# Altium schematic sheet Top_Level.SchDoc
size D
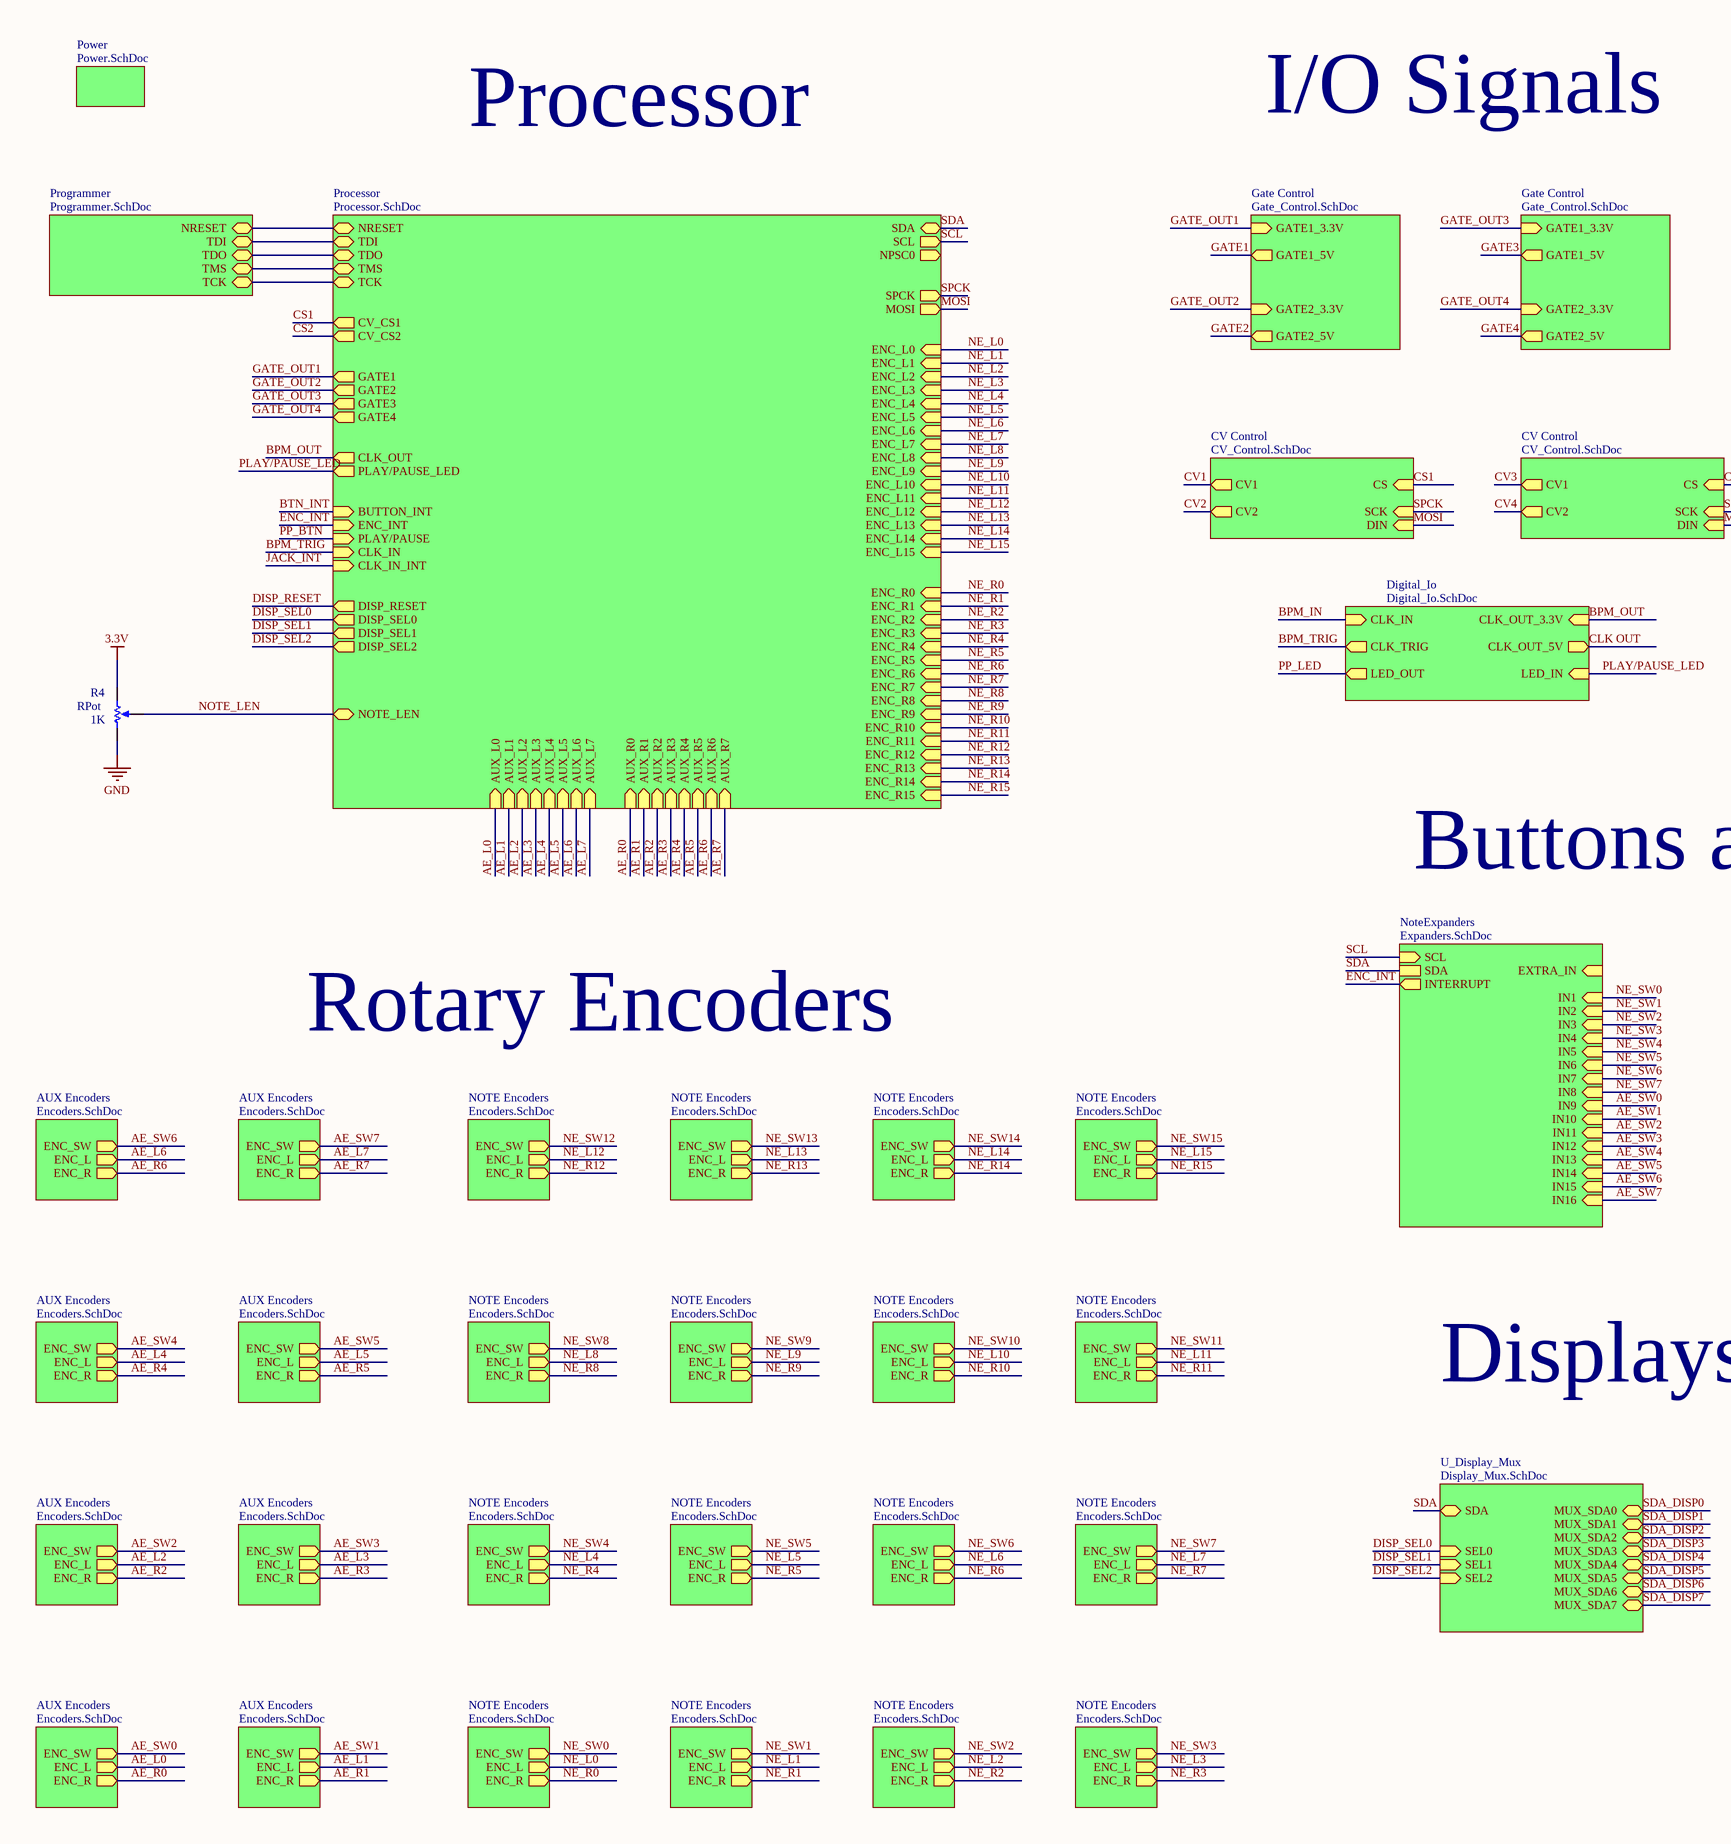
[diagram p0: Top_Level.SchDoc, left]
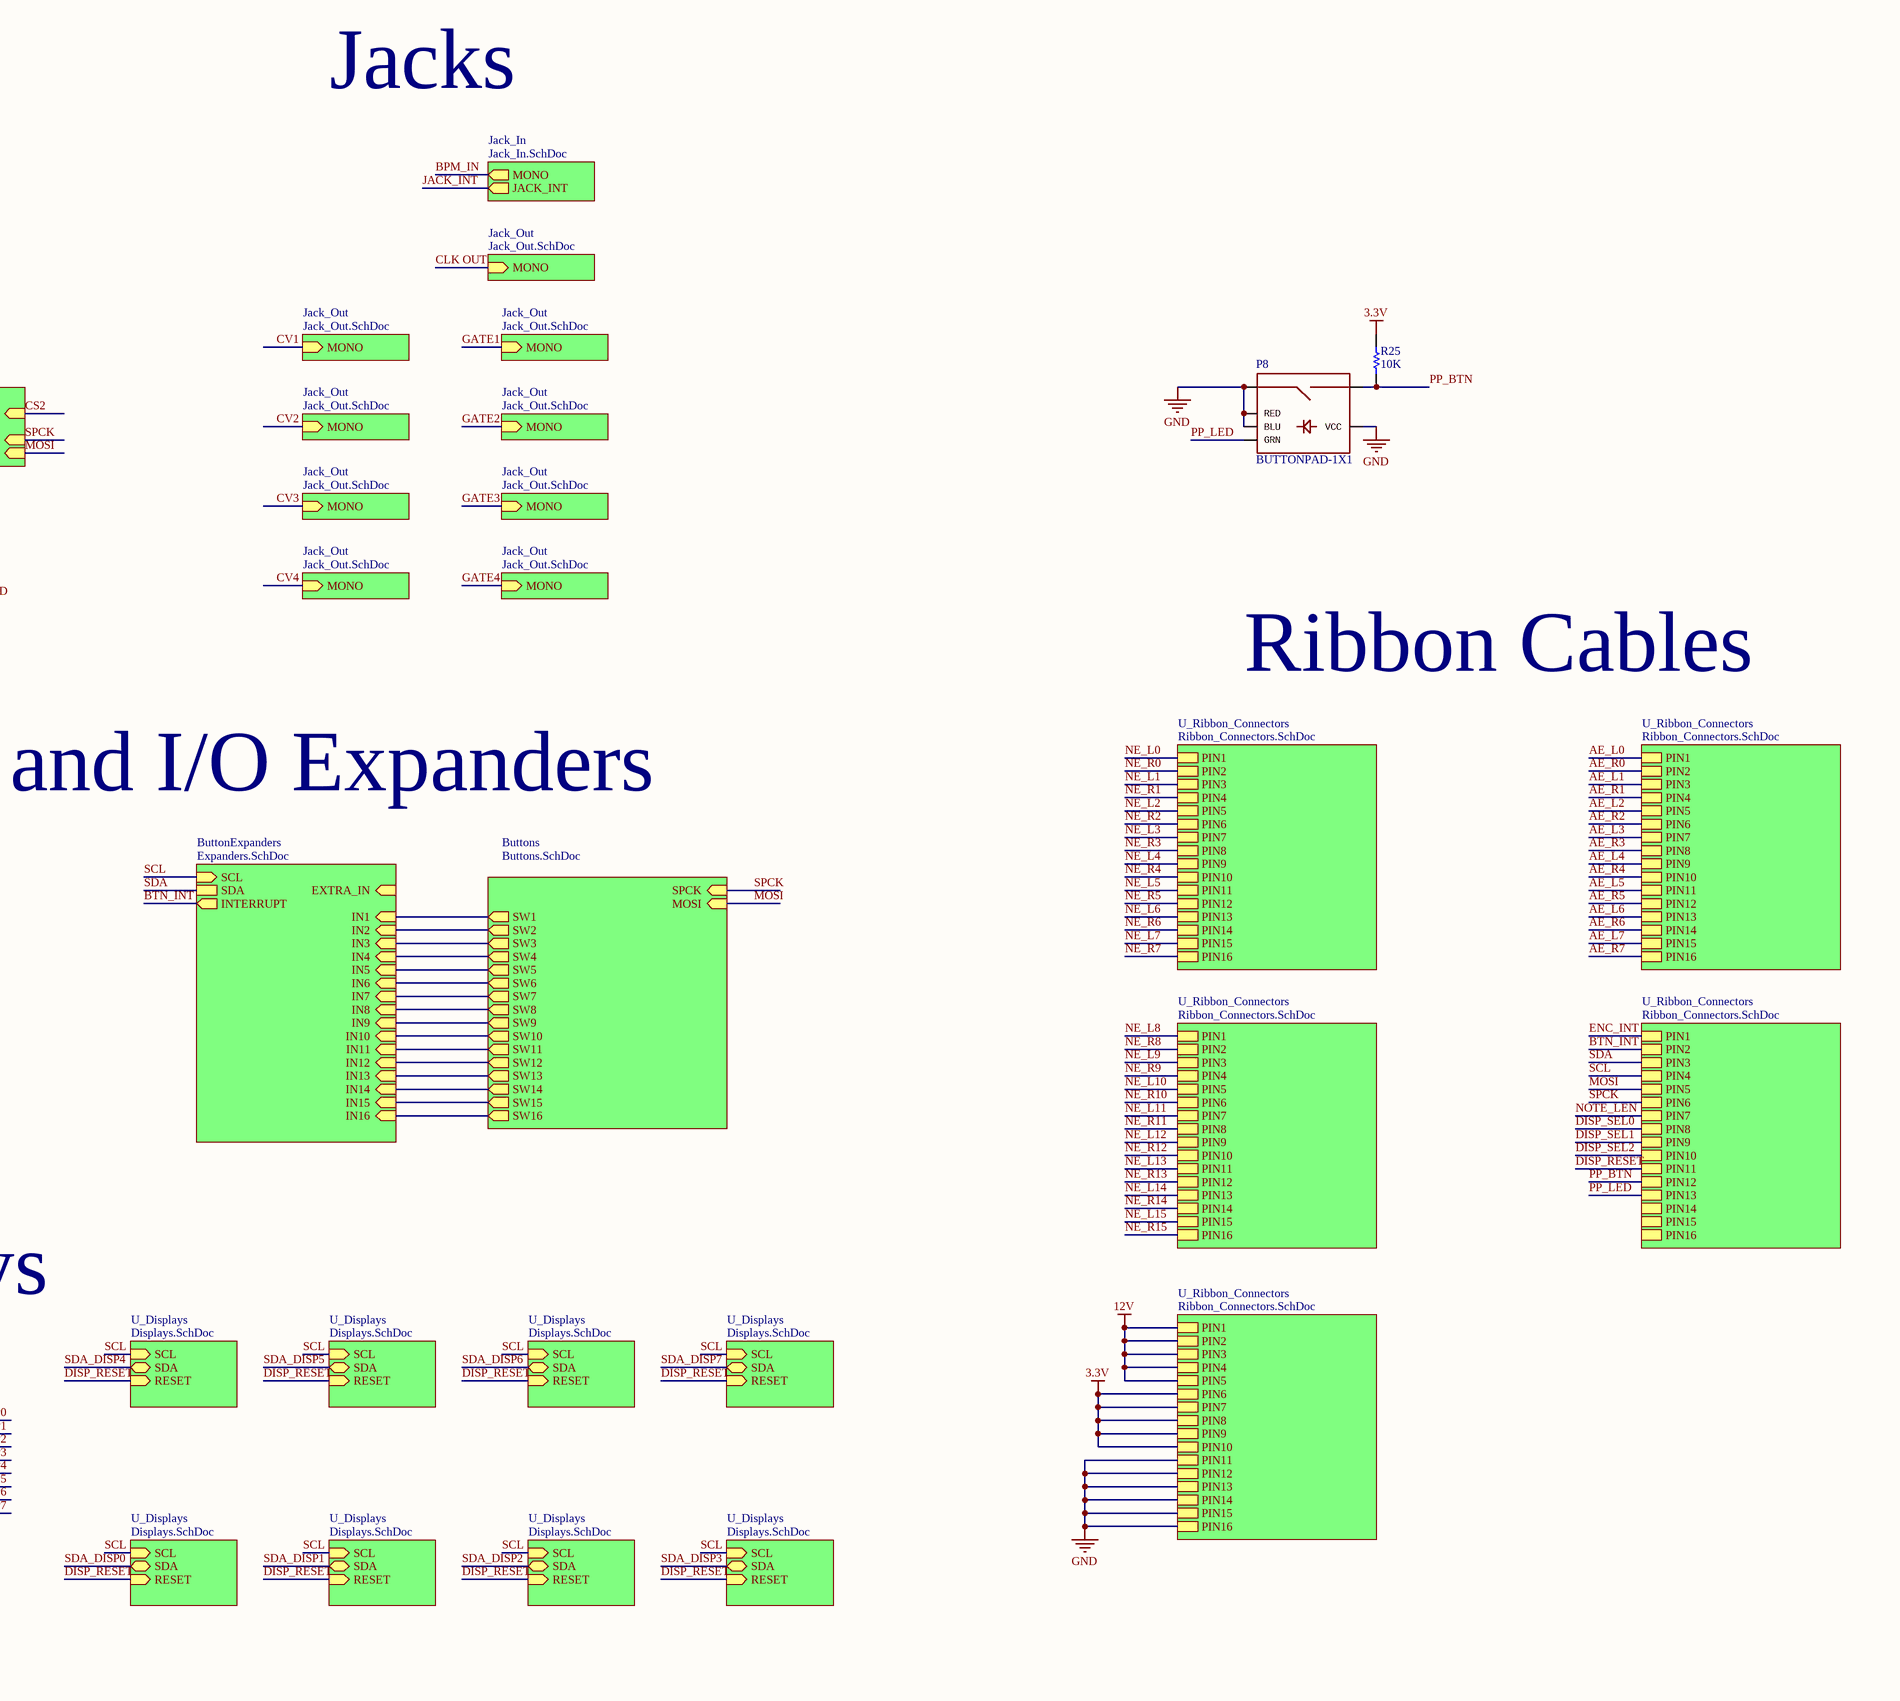
[diagram p1: Top_Level.SchDoc, right]

## Parts
P8  BUTTONPAD-1X1  [BUTTONPAD-1X1]
R4  RPot  value 1K  [POT inline wide]
R25  value 10K  [AXIAL-0.3]  (hidden comment: R3)

## Sub-sheets
AUX Encoders = Encoders.SchDoc: ENC_SW (out), ENC_L (out), ENC_R (out)
AUX Encoders = Encoders.SchDoc: ENC_SW (out), ENC_L (out), ENC_R (out)
AUX Encoders = Encoders.SchDoc: ENC_SW (out), ENC_L (out), ENC_R (out)
AUX Encoders = Encoders.SchDoc: ENC_SW (out), ENC_L (out), ENC_R (out)
AUX Encoders = Encoders.SchDoc: ENC_SW (out), ENC_L (out), ENC_R (out)
AUX Encoders = Encoders.SchDoc: ENC_SW (out), ENC_L (out), ENC_R (out)
AUX Encoders = Encoders.SchDoc: ENC_SW (out), ENC_L (out), ENC_R (out)
AUX Encoders = Encoders.SchDoc: ENC_SW (out), ENC_L (out), ENC_R (out)
ButtonExpanders = Expanders.SchDoc: SCL (in), SDA, EXTRA_IN (in), INTERRUPT (out), IN1 (in), IN2 (in), IN3 (in), IN4 (in), IN5 (in), IN6 (in), IN7 (in), IN8 (in), IN9 (in), IN10 (in), IN11 (in), IN12 (in), IN13 (in), IN14 (in), IN15 (in), IN16 (in)
Buttons = Buttons.SchDoc: SPCK (in), MOSI (in), SW1 (out), SW2 (out), SW3 (out), SW4 (out), SW5 (out), SW6 (out), SW7 (out), SW8 (out), SW9 (out), SW10 (out), SW11 (out), SW12 (out), SW13 (out), SW14 (out), SW15 (out), SW16 (out)
CV Control = CV_Control.SchDoc: CS (in), SCK (in), DIN (in), CV1 (out), CV2 (out)
CV Control = CV_Control.SchDoc: CS (in), SCK (in), DIN (in), CV1 (out), CV2 (out)
Digital_Io = Digital_Io.SchDoc: CLK_IN (in), CLK_TRIG (out), LED_IN (in), CLK_OUT_3.3V (in), CLK_OUT_5V (out), LED_OUT (out)
Gate Control = Gate_Control.SchDoc: GATE1_3.3V (in), GATE2_3.3V (in), GATE1_5V (out), GATE2_5V (out)
Gate Control = Gate_Control.SchDoc: GATE1_3.3V (in), GATE2_3.3V (in), GATE1_5V (out), GATE2_5V (out)
Jack_In = Jack_In.SchDoc: MONO (out), JACK_INT (out)
Jack_Out = Jack_Out.SchDoc: MONO (in)
Jack_Out = Jack_Out.SchDoc: MONO (in)
Jack_Out = Jack_Out.SchDoc: MONO (in)
Jack_Out = Jack_Out.SchDoc: MONO (in)
Jack_Out = Jack_Out.SchDoc: MONO (in)
Jack_Out = Jack_Out.SchDoc: MONO (in)
Jack_Out = Jack_Out.SchDoc: MONO (in)
Jack_Out = Jack_Out.SchDoc: MONO (in)
Jack_Out = Jack_Out.SchDoc: MONO (in)
NOTE Encoders = Encoders.SchDoc: ENC_SW (out), ENC_L (out), ENC_R (out)
NOTE Encoders = Encoders.SchDoc: ENC_SW (out), ENC_L (out), ENC_R (out)
NOTE Encoders = Encoders.SchDoc: ENC_SW (out), ENC_L (out), ENC_R (out)
NOTE Encoders = Encoders.SchDoc: ENC_SW (out), ENC_L (out), ENC_R (out)
NOTE Encoders = Encoders.SchDoc: ENC_SW (out), ENC_L (out), ENC_R (out)
NOTE Encoders = Encoders.SchDoc: ENC_SW (out), ENC_L (out), ENC_R (out)
NOTE Encoders = Encoders.SchDoc: ENC_SW (out), ENC_L (out), ENC_R (out)
NOTE Encoders = Encoders.SchDoc: ENC_SW (out), ENC_L (out), ENC_R (out)
NOTE Encoders = Encoders.SchDoc: ENC_SW (out), ENC_L (out), ENC_R (out)
NOTE Encoders = Encoders.SchDoc: ENC_SW (out), ENC_L (out), ENC_R (out)
NOTE Encoders = Encoders.SchDoc: ENC_SW (out), ENC_L (out), ENC_R (out)
NOTE Encoders = Encoders.SchDoc: ENC_SW (out), ENC_L (out), ENC_R (out)
NOTE Encoders = Encoders.SchDoc: ENC_SW (out), ENC_L (out), ENC_R (out)
NOTE Encoders = Encoders.SchDoc: ENC_SW (out), ENC_L (out), ENC_R (out)
NOTE Encoders = Encoders.SchDoc: ENC_SW (out), ENC_L (out), ENC_R (out)
NOTE Encoders = Encoders.SchDoc: ENC_SW (out), ENC_L (out), ENC_R (out)
NoteExpanders = Expanders.SchDoc: SCL (in), SDA, EXTRA_IN (in), INTERRUPT (out), IN1 (in), IN2 (in), IN3 (in), IN4 (in), IN5 (in), IN6 (in), IN7 (in), IN8 (in), IN9 (in), IN10 (in), IN11 (in), IN12 (in), IN13 (in), IN14 (in), IN15 (in), IN16 (in)
Power = Power.SchDoc: no entries
Processor = Processor.SchDoc: MOSI (out), SPCK (out), NPSC0 (out), SDA (bidir), SCL (out), NRESET (bidir), TDI (bidir), TDO (bidir), TMS (bidir), TCK (bidir), GATE1 (out), GATE2 (out), GATE3 (out), GATE4 (out), BUTTON_INT (in), ENC_INT (in), PLAY/PAUSE (in), CLK_IN (in), CLK_IN_INT (in), CLK_OUT (out), DISP_RESET (out), PLAY/PAUSE_LED (out), CV_CS2 (out), CV_CS1 (out), AUX_L0 (in), AUX_L1 (in), AUX_L2 (in), AUX_L3 (in), AUX_L4 (in), AUX_L5 (in), AUX_L6 (in), AUX_L7 (in), AUX_R0 (in), AUX_R1 (in), AUX_R2 (in), AUX_R3 (in), AUX_R4 (in), AUX_R5 (in), AUX_R6 (in), AUX_R7 (in), DISP_SEL0 (out), DISP_SEL1 (out), DISP_SEL2 (out), ENC_L0 (in), ENC_L1 (in), ENC_L2 (in), ENC_L3 (in), ENC_L4 (in), ENC_L5 (in), ENC_L6 (in), ENC_L7 (in), ENC_L8 (in), ENC_L9 (in), ENC_L10 (in), ENC_L11 (in), ENC_L12 (in), ENC_L13 (in), ENC_L14 (in), ENC_L15 (in), ENC_R0 (in), ENC_R1 (in), ENC_R2 (in), ENC_R3 (in), ENC_R4 (in), ENC_R5 (in), ENC_R6 (in), ENC_R7 (in), ENC_R8 (in), ENC_R9 (in), ENC_R10 (in), ENC_R11 (in), ENC_R12 (in), ENC_R13 (in), ENC_R14 (in), ENC_R15 (in), NOTE_LEN
Programmer = Programmer.SchDoc: TMS (bidir), TCK (bidir), TDO (bidir), TDI (bidir), NRESET (bidir)
U_Display_Mux = Display_Mux.SchDoc: SEL1 (in), SEL2 (in), MUX_SDA0 (bidir), MUX_SDA1 (bidir), MUX_SDA2 (bidir), MUX_SDA3 (bidir), MUX_SDA4 (bidir), MUX_SDA5 (bidir), MUX_SDA6 (bidir), MUX_SDA7 (bidir), SDA (bidir), SEL0 (in)
U_Displays = Displays.SchDoc: SCL (in), SDA (bidir), RESET (in)
U_Displays = Displays.SchDoc: SCL (in), SDA (bidir), RESET (in)
U_Displays = Displays.SchDoc: SCL (in), SDA (bidir), RESET (in)
U_Displays = Displays.SchDoc: SCL (in), SDA (bidir), RESET (in)
U_Displays = Displays.SchDoc: SCL (in), SDA (bidir), RESET (in)
U_Displays = Displays.SchDoc: SCL (in), SDA (bidir), RESET (in)
U_Displays = Displays.SchDoc: SCL (in), SDA (bidir), RESET (in)
U_Displays = Displays.SchDoc: SCL (in), SDA (bidir), RESET (in)
U_Ribbon_Connectors = Ribbon_Connectors.SchDoc: PIN1, PIN2, PIN3, PIN4, PIN5, PIN6, PIN7, PIN8, PIN9, PIN10, PIN11, PIN12, PIN13, PIN14, PIN15, PIN16
U_Ribbon_Connectors = Ribbon_Connectors.SchDoc: PIN1, PIN2, PIN3, PIN4, PIN5, PIN6, PIN7, PIN8, PIN9, PIN10, PIN11, PIN12, PIN13, PIN14, PIN15, PIN16
U_Ribbon_Connectors = Ribbon_Connectors.SchDoc: PIN1, PIN2, PIN3, PIN4, PIN5, PIN6, PIN7, PIN8, PIN9, PIN10, PIN11, PIN12, PIN13, PIN14, PIN15, PIN16
U_Ribbon_Connectors = Ribbon_Connectors.SchDoc: PIN1, PIN2, PIN3, PIN4, PIN5, PIN6, PIN7, PIN8, PIN9, PIN10, PIN11, PIN12, PIN13, PIN14, PIN15, PIN16
U_Ribbon_Connectors = Ribbon_Connectors.SchDoc: PIN1, PIN2, PIN3, PIN4, PIN5, PIN6, PIN7, PIN8, PIN9, PIN10, PIN11, PIN12, PIN13, PIN14, PIN15, PIN16

## Nets
3.3V: R4.2(BOT) R25.2 ; sheet U_Ribbon_Connectors/PIN6, sheet U_Ribbon_Connectors/PIN7, sheet U_Ribbon_Connectors/PIN8, sheet U_Ribbon_Connectors/PIN9, sheet U_Ribbon_Connectors/PIN10
12V: sheet U_Ribbon_Connectors/PIN1, sheet U_Ribbon_Connectors/PIN2, sheet U_Ribbon_Connectors/PIN3, sheet U_Ribbon_Connectors/PIN4, sheet U_Ribbon_Connectors/PIN5
GND: P8.BLU1(BLU) P8.RED1(RED) P8.SIG1 P8.VCC1(VCC) R4.1(TOP) ; sheet U_Ribbon_Connectors/PIN11, sheet U_Ribbon_Connectors/PIN12, sheet U_Ribbon_Connectors/PIN13, sheet U_Ribbon_Connectors/PIN14, sheet U_Ribbon_Connectors/PIN15, sheet U_Ribbon_Connectors/PIN16
AE_L0: sheet Processor/AUX_L0, sheet AUX Encoders/ENC_L, sheet U_Ribbon_Connectors/PIN1
AE_L1: sheet Processor/AUX_L1, sheet AUX Encoders/ENC_L, sheet U_Ribbon_Connectors/PIN3
AE_L2: sheet Processor/AUX_L2, sheet AUX Encoders/ENC_L, sheet U_Ribbon_Connectors/PIN5
AE_L3: sheet Processor/AUX_L3, sheet AUX Encoders/ENC_L, sheet U_Ribbon_Connectors/PIN7
AE_L4: sheet Processor/AUX_L4, sheet AUX Encoders/ENC_L, sheet U_Ribbon_Connectors/PIN9
AE_L5: sheet Processor/AUX_L5, sheet AUX Encoders/ENC_L, sheet U_Ribbon_Connectors/PIN11
AE_L6: sheet Processor/AUX_L6, sheet AUX Encoders/ENC_L, sheet U_Ribbon_Connectors/PIN13
AE_L7: sheet Processor/AUX_L7, sheet AUX Encoders/ENC_L, sheet U_Ribbon_Connectors/PIN15
AE_R0: sheet Processor/AUX_R0, sheet AUX Encoders/ENC_R, sheet U_Ribbon_Connectors/PIN2
AE_R1: sheet Processor/AUX_R1, sheet AUX Encoders/ENC_R, sheet U_Ribbon_Connectors/PIN4
AE_R2: sheet Processor/AUX_R2, sheet AUX Encoders/ENC_R, sheet U_Ribbon_Connectors/PIN6
AE_R3: sheet Processor/AUX_R3, sheet AUX Encoders/ENC_R, sheet U_Ribbon_Connectors/PIN8
AE_R4: sheet Processor/AUX_R4, sheet AUX Encoders/ENC_R, sheet U_Ribbon_Connectors/PIN10
AE_R5: sheet Processor/AUX_R5, sheet AUX Encoders/ENC_R, sheet U_Ribbon_Connectors/PIN12
AE_R6: sheet Processor/AUX_R6, sheet AUX Encoders/ENC_R, sheet U_Ribbon_Connectors/PIN14
AE_R7: sheet Processor/AUX_R7, sheet AUX Encoders/ENC_R, sheet U_Ribbon_Connectors/PIN16
AE_SW0: sheet NoteExpanders/IN9, sheet AUX Encoders/ENC_SW
AE_SW1: sheet NoteExpanders/IN10, sheet AUX Encoders/ENC_SW
AE_SW2: sheet NoteExpanders/IN11, sheet AUX Encoders/ENC_SW
AE_SW3: sheet NoteExpanders/IN12, sheet AUX Encoders/ENC_SW
AE_SW4: sheet NoteExpanders/IN13, sheet AUX Encoders/ENC_SW
AE_SW5: sheet NoteExpanders/IN14, sheet AUX Encoders/ENC_SW
AE_SW6: sheet NoteExpanders/IN15, sheet AUX Encoders/ENC_SW
AE_SW7: sheet NoteExpanders/IN16, sheet AUX Encoders/ENC_SW
BPM_IN: sheet Jack_In/MONO, sheet Digital_Io/CLK_IN
BPM_OUT: sheet Processor/CLK_OUT, sheet Digital_Io/CLK_OUT_3.3V
BPM_TRIG: sheet Processor/CLK_IN, sheet Digital_Io/CLK_TRIG
BTN_INT: sheet Processor/BUTTON_INT, sheet ButtonExpanders/INTERRUPT, sheet U_Ribbon_Connectors/PIN2
CLK OUT: sheet Digital_Io/CLK_OUT_5V, sheet Jack_Out/MONO
CS1: sheet Processor/CV_CS1, sheet CV Control/CS
CS2: sheet Processor/CV_CS2, sheet CV Control/CS
CV1: sheet CV Control/CV1, sheet Jack_Out/MONO
CV2: sheet CV Control/CV2, sheet Jack_Out/MONO
CV3: sheet CV Control/CV1, sheet Jack_Out/MONO
CV4: sheet CV Control/CV2, sheet Jack_Out/MONO
DISP_RESET: sheet Processor/DISP_RESET, sheet U_Displays/RESET, sheet U_Displays/RESET, sheet U_Displays/RESET, sheet U_Displays/RESET, sheet U_Displays/RESET, sheet U_Displays/RESET, sheet U_Displays/RESET, sheet U_Displays/RESET, sheet U_Ribbon_Connectors/PIN11
DISP_SEL0: sheet Processor/DISP_SEL0, sheet U_Display_Mux/SEL0, sheet U_Ribbon_Connectors/PIN8
DISP_SEL1: sheet Processor/DISP_SEL1, sheet U_Display_Mux/SEL1, sheet U_Ribbon_Connectors/PIN9
DISP_SEL2: sheet Processor/DISP_SEL2, sheet U_Display_Mux/SEL2, sheet U_Ribbon_Connectors/PIN10
ENC_INT: sheet Processor/ENC_INT, sheet NoteExpanders/INTERRUPT, sheet U_Ribbon_Connectors/PIN1
GATE1: sheet Gate Control/GATE1_5V, sheet Jack_Out/MONO
GATE2: sheet Gate Control/GATE2_5V, sheet Jack_Out/MONO
GATE3: sheet Gate Control/GATE1_5V, sheet Jack_Out/MONO
GATE4: sheet Gate Control/GATE2_5V, sheet Jack_Out/MONO
GATE_OUT1: sheet Processor/GATE1, sheet Gate Control/GATE1_3.3V
GATE_OUT2: sheet Processor/GATE2, sheet Gate Control/GATE2_3.3V
GATE_OUT3: sheet Gate Control/GATE1_3.3V, sheet Processor/GATE3
GATE_OUT4: sheet Gate Control/GATE2_3.3V, sheet Processor/GATE4
JACK_INT: sheet Processor/CLK_IN_INT, sheet Jack_In/JACK_INT
MOSI: sheet Processor/MOSI, sheet Buttons/MOSI, sheet CV Control/DIN, sheet CV Control/DIN, sheet U_Ribbon_Connectors/PIN5
NE_L0: sheet Processor/ENC_L0, sheet NOTE Encoders/ENC_L, sheet U_Ribbon_Connectors/PIN1
NE_L1: sheet Processor/ENC_L1, sheet NOTE Encoders/ENC_L, sheet U_Ribbon_Connectors/PIN3
NE_L2: sheet Processor/ENC_L2, sheet NOTE Encoders/ENC_L, sheet U_Ribbon_Connectors/PIN5
NE_L3: sheet Processor/ENC_L3, sheet NOTE Encoders/ENC_L, sheet U_Ribbon_Connectors/PIN7
NE_L4: sheet Processor/ENC_L4, sheet NOTE Encoders/ENC_L, sheet U_Ribbon_Connectors/PIN9
NE_L5: sheet Processor/ENC_L5, sheet NOTE Encoders/ENC_L, sheet U_Ribbon_Connectors/PIN11
NE_L6: sheet Processor/ENC_L6, sheet NOTE Encoders/ENC_L, sheet U_Ribbon_Connectors/PIN13
NE_L7: sheet Processor/ENC_L7, sheet NOTE Encoders/ENC_L, sheet U_Ribbon_Connectors/PIN15
NE_L8: sheet Processor/ENC_L8, sheet NOTE Encoders/ENC_L, sheet U_Ribbon_Connectors/PIN1
NE_L9: sheet Processor/ENC_L9, sheet NOTE Encoders/ENC_L, sheet U_Ribbon_Connectors/PIN3
NE_L10: sheet Processor/ENC_L10, sheet NOTE Encoders/ENC_L, sheet U_Ribbon_Connectors/PIN5
NE_L11: sheet Processor/ENC_L11, sheet NOTE Encoders/ENC_L, sheet U_Ribbon_Connectors/PIN7
NE_L12: sheet Processor/ENC_L12, sheet NOTE Encoders/ENC_L, sheet U_Ribbon_Connectors/PIN9
NE_L13: sheet Processor/ENC_L13, sheet NOTE Encoders/ENC_L, sheet U_Ribbon_Connectors/PIN11
NE_L14: sheet Processor/ENC_L14, sheet NOTE Encoders/ENC_L, sheet U_Ribbon_Connectors/PIN13
NE_L15: sheet Processor/ENC_L15, sheet NOTE Encoders/ENC_L, sheet U_Ribbon_Connectors/PIN15
NE_R0: sheet Processor/ENC_R0, sheet NOTE Encoders/ENC_R, sheet U_Ribbon_Connectors/PIN2
NE_R1: sheet Processor/ENC_R1, sheet NOTE Encoders/ENC_R, sheet U_Ribbon_Connectors/PIN4
NE_R2: sheet Processor/ENC_R2, sheet NOTE Encoders/ENC_R, sheet U_Ribbon_Connectors/PIN6
NE_R3: sheet Processor/ENC_R3, sheet NOTE Encoders/ENC_R, sheet U_Ribbon_Connectors/PIN8
NE_R4: sheet Processor/ENC_R4, sheet NOTE Encoders/ENC_R, sheet U_Ribbon_Connectors/PIN10
NE_R5: sheet Processor/ENC_R5, sheet NOTE Encoders/ENC_R, sheet U_Ribbon_Connectors/PIN12
NE_R6: sheet Processor/ENC_R6, sheet NOTE Encoders/ENC_R, sheet U_Ribbon_Connectors/PIN14
NE_R7: sheet Processor/ENC_R7, sheet NOTE Encoders/ENC_R, sheet U_Ribbon_Connectors/PIN16
NE_R8: sheet Processor/ENC_R8, sheet NOTE Encoders/ENC_R, sheet U_Ribbon_Connectors/PIN2
NE_R9: sheet Processor/ENC_R9, sheet NOTE Encoders/ENC_R, sheet U_Ribbon_Connectors/PIN4
NE_R10: sheet Processor/ENC_R10, sheet NOTE Encoders/ENC_R, sheet U_Ribbon_Connectors/PIN6
NE_R11: sheet Processor/ENC_R11, sheet NOTE Encoders/ENC_R, sheet U_Ribbon_Connectors/PIN8
NE_R12: sheet Processor/ENC_R12, sheet NOTE Encoders/ENC_R, sheet U_Ribbon_Connectors/PIN10
NE_R13: sheet Processor/ENC_R13, sheet NOTE Encoders/ENC_R, sheet U_Ribbon_Connectors/PIN12
NE_R14: sheet Processor/ENC_R14, sheet NOTE Encoders/ENC_R, sheet U_Ribbon_Connectors/PIN14
NE_R15: sheet Processor/ENC_R15, sheet NOTE Encoders/ENC_R, sheet U_Ribbon_Connectors/PIN16
NE_SW0: sheet NoteExpanders/IN1, sheet NOTE Encoders/ENC_SW
NE_SW1: sheet NoteExpanders/IN2, sheet NOTE Encoders/ENC_SW
NE_SW2: sheet NoteExpanders/IN3, sheet NOTE Encoders/ENC_SW
NE_SW3: sheet NoteExpanders/IN4, sheet NOTE Encoders/ENC_SW
NE_SW4: sheet NoteExpanders/IN5, sheet NOTE Encoders/ENC_SW
NE_SW5: sheet NoteExpanders/IN6, sheet NOTE Encoders/ENC_SW
NE_SW6: sheet NoteExpanders/IN7, sheet NOTE Encoders/ENC_SW
NE_SW7: sheet NoteExpanders/IN8, sheet NOTE Encoders/ENC_SW
NE_SW8: sheet NOTE Encoders/ENC_SW
NE_SW9: sheet NOTE Encoders/ENC_SW
NE_SW10: sheet NOTE Encoders/ENC_SW
NE_SW11: sheet NOTE Encoders/ENC_SW
NE_SW12: sheet NOTE Encoders/ENC_SW
NE_SW13: sheet NOTE Encoders/ENC_SW
NE_SW14: sheet NOTE Encoders/ENC_SW
NE_SW15: sheet NOTE Encoders/ENC_SW
NOTE_LEN: R4.3(TAP) ; sheet Processor/NOTE_LEN, sheet U_Ribbon_Connectors/PIN7
PLAY/PAUSE_LED: sheet Processor/PLAY/PAUSE_LED, sheet Digital_Io/LED_IN
PP_BTN: P8.SIG2 R25.1 ; sheet Processor/PLAY/PAUSE, sheet U_Ribbon_Connectors/PIN12
PP_LED: P8.GRN1(GRN) ; sheet Digital_Io/LED_OUT, sheet U_Ribbon_Connectors/PIN13
SCL: sheet Processor/SCL, sheet ButtonExpanders/SCL, sheet NoteExpanders/SCL, sheet U_Displays/SCL, sheet U_Displays/SCL, sheet U_Displays/SCL, sheet U_Displays/SCL, sheet U_Displays/SCL, sheet U_Displays/SCL, sheet U_Displays/SCL, sheet U_Displays/SCL, sheet U_Ribbon_Connectors/PIN4
SDA: sheet Processor/SDA, sheet ButtonExpanders/SDA, sheet NoteExpanders/SDA, sheet U_Display_Mux/SDA, sheet U_Ribbon_Connectors/PIN3
SDA_DISP0: sheet U_Display_Mux/MUX_SDA0, sheet U_Displays/SDA
SDA_DISP1: sheet U_Display_Mux/MUX_SDA1, sheet U_Displays/SDA
SDA_DISP2: sheet U_Display_Mux/MUX_SDA2, sheet U_Displays/SDA
SDA_DISP3: sheet U_Display_Mux/MUX_SDA3, sheet U_Displays/SDA
SDA_DISP4: sheet U_Display_Mux/MUX_SDA4, sheet U_Displays/SDA
SDA_DISP5: sheet U_Display_Mux/MUX_SDA5, sheet U_Displays/SDA
SDA_DISP6: sheet U_Display_Mux/MUX_SDA6, sheet U_Displays/SDA
SDA_DISP7: sheet U_Display_Mux/MUX_SDA7, sheet U_Displays/SDA
SPCK: sheet Processor/SPCK, sheet Buttons/SPCK, sheet CV Control/SCK, sheet CV Control/SCK, sheet U_Ribbon_Connectors/PIN6
(unnamed): sheet Programmer/TMS, sheet Processor/TMS
(unnamed): sheet Programmer/TCK, sheet Processor/TCK
(unnamed): sheet Programmer/TDO, sheet Processor/TDO
(unnamed): sheet Programmer/TDI, sheet Processor/TDI
(unnamed): sheet Programmer/NRESET, sheet Processor/NRESET
(unnamed): sheet Buttons/SW1, sheet ButtonExpanders/IN1
(unnamed): sheet Buttons/SW2, sheet ButtonExpanders/IN2
(unnamed): sheet Buttons/SW3, sheet ButtonExpanders/IN3
(unnamed): sheet Buttons/SW4, sheet ButtonExpanders/IN4
(unnamed): sheet Buttons/SW5, sheet ButtonExpanders/IN5
(unnamed): sheet Buttons/SW6, sheet ButtonExpanders/IN6
(unnamed): sheet Buttons/SW7, sheet ButtonExpanders/IN7
(unnamed): sheet Buttons/SW8, sheet ButtonExpanders/IN8
(unnamed): sheet Buttons/SW9, sheet ButtonExpanders/IN9
(unnamed): sheet Buttons/SW10, sheet ButtonExpanders/IN10
(unnamed): sheet Buttons/SW11, sheet ButtonExpanders/IN11
(unnamed): sheet Buttons/SW12, sheet ButtonExpanders/IN12
(unnamed): sheet Buttons/SW13, sheet ButtonExpanders/IN13
(unnamed): sheet Buttons/SW14, sheet ButtonExpanders/IN14
(unnamed): sheet Buttons/SW15, sheet ButtonExpanders/IN15
(unnamed): sheet Buttons/SW16, sheet ButtonExpanders/IN16

## Notes on the sheet
- Processor
- I/O Signals
- Jacks
- Ribbon Cables
- Buttons and I/O Expanders
- Rotary Encoders
- Displays

## Library data of the parts
R4 = RPot: Potentiometer; Sim Note: Enter the Resistance value and the set point into parameter fields.; Set Position: 0.5; Published: 8-Jun-2000; LatestRevisionDate: 17-Jul-2002; LatestRevisionNote: Re-released for DXP Platform.; PackageReference: VR5; Publisher: Altium Limited; PackageDescription: Variable Resistor, Thru-Hole; 3 Leads
R25 = Res1: Resistor; Published: 8-Jun-2000; LatestRevisionDate: 17-Jul-2002; LatestRevisionNote: Re-released for DXP Platform.; PackageReference: AXIAL-0.3; Publisher: Altium Limited; PackageDescription: Axial Device, Thru-Hole; 2 Leads; 0.3 in Pin Spacing